# EasyEDA Pro project ProDoc_XIAOntegratedV2_2025-09-06.epro

# Schematic XIAOntegrated_1
Board Name: XIAOntegratedV2; Create Date: 2025-07-04; Page Name: MCU; Project Name: XIAOntegrated; Schematic Name: XIAOntegrated_1; Update Date: 2025-07-05; Company: EasyEDA.com; Page Size: A4; Version: V1.0
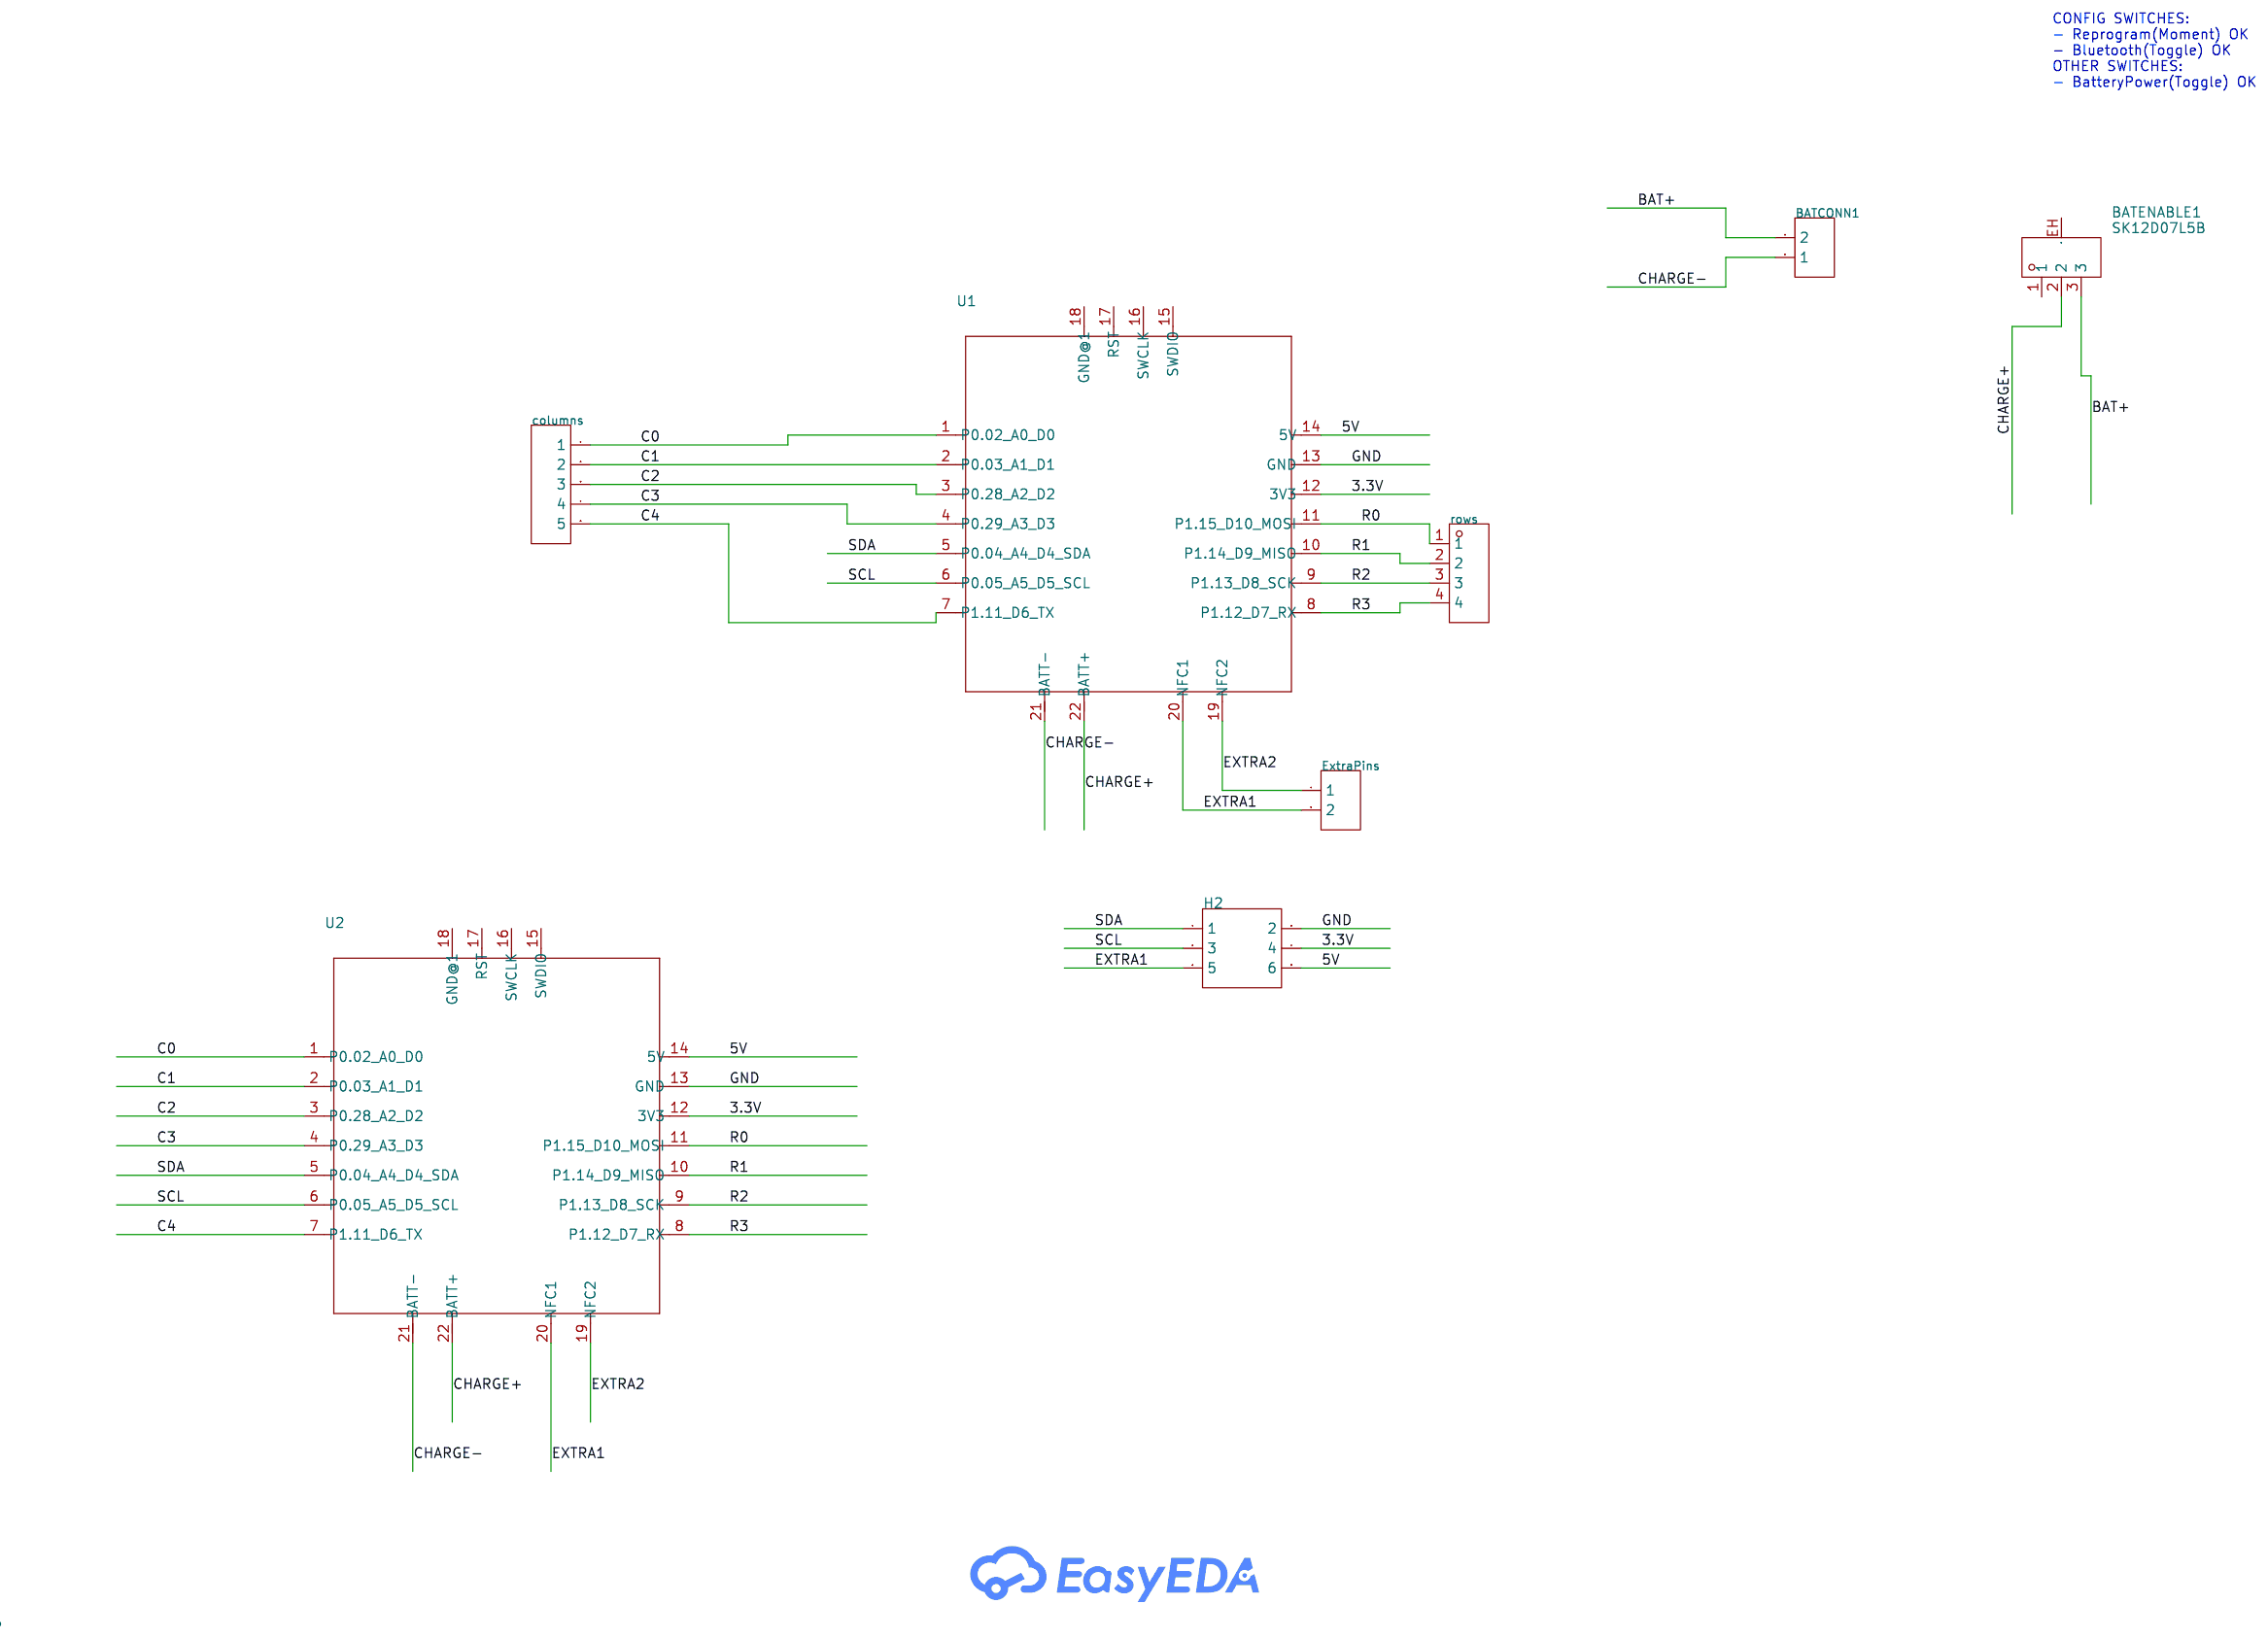
[diagram p0: schematic sheet]

## Parts
BATCONN1  -  [HDR-TH_2P-P2.54-V-F]
BATENABLE1  SK12D07L5B  [SW-TH_SK-12D07-X-X]
columns  -  [HDR-TH_5P-P2.54-V-F]
ExtraPins  -  [HDR-TH_2P-P2.54-V-F]
H2  -  [HDR-TH_6P-P2.54-V-F-R2-C3-S2.54]
rows  -  [HDR-TH_4P-P2.54-V-F]
U1  -  [XIAO-NRF52840/SENSE-MODULE14P-2.54-21X17.8MM]
U2  -  [XIAO-NRF52840/SENSE-MODULE14P-2.54-21X17.8MM]

## Library data of the parts
BATCONN1 ExtraPins = HDR-F_2.54_1x2P: Supplier Footprint: Through
BATENABLE1 = SK12D07L5B: Circuit:Single Pole Double Throw (SPDT) Actuator Style:Rectangular column Pin Style:PCPin Switch Length:8.6mm Switch Width:4.5mm Switch Height:4.7mm Mounting Style:- Actuator Color:Black Current Rating (DC):300mA Voltage Rating (DC):50V Current Rating (AC; LCSC Part Name: 2档侧拨手感极佳抗腐蚀24小时柄高5MM拨动开关SK-12D07-L5-B; Supplier Part: C480341; Manufacturer: XKB Connection(中国星坤); Supplier Footprint: 插件; JLCPCB Part Class: Extended Part; Datasheet: https://atta.szlcsc.com/upload/public/pdf/source/20211011/D45CBC84858A875519D538ABAE79099F.pdf; Supplier: LCSC; Circuit: Single Pole Double Throw (SPDT); Actuator Style: Rectangular column; Pin Style: PCPin; Switch Length: 8.6mm; Switch Width: 4.5mm; Switch Height: 4.7mm; Actuator Color: Black; Current Rating (DC): 300mA; Voltage Rating (DC): 50V; Current Rating (AC): 300mA; Voltage Rating (AC): 50V; Mechanical Life: 10000 times; Operating Temperature: -40℃~+85℃
columns = HDR-F_2.54_1x5P: Supplier Footprint: Through
H2 = HDR-F-2.54_2x3: Supplier Footprint: Through
rows = HDR-F_2.54_1x4P: Supplier Footprint: Through
U1 U2 = XIAO-NRF52840/SENSE_

## Nets
3.3V: H2.4 U1.12(3V3) U2.12(3V3)
5V: H2.6 U1.14(5V) U2.14(5V)
GND: H2.2 U1.13(GND) U2.13(GND)
BAT+: BATCONN1.2 BATENABLE1.3
C0: columns.1 U1.1(P0.02_A0_D0) U2.1(P0.02_A0_D0)
C1: columns.2 U1.2(P0.03_A1_D1) U2.2(P0.03_A1_D1)
C2: columns.3 U1.3(P0.28_A2_D2) U2.3(P0.28_A2_D2)
C3: columns.4 U1.4(P0.29_A3_D3) U2.4(P0.29_A3_D3)
C4: columns.5 U1.7(P1.11_D6_TX) U2.7(P1.11_D6_TX)
CHARGE+: BATENABLE1.2 U1.22(BATT+) U2.22(BATT+)
CHARGE-: BATCONN1.1 U1.21(BATT-) U2.21(BATT-)
EXTRA1: ExtraPins.2 H2.5 U1.20(NFC1) U2.20(NFC1)
EXTRA2: ExtraPins.1 U1.19(NFC2) U2.19(NFC2)
R0: rows.1 U1.11(P1.15_D10_MOSI) U2.11(P1.15_D10_MOSI)
R1: rows.2 U1.10(P1.14_D9_MISO) U2.10(P1.14_D9_MISO)
R2: rows.3 U1.9(P1.13_D8_SCK) U2.9(P1.13_D8_SCK)
R3: rows.4 U1.8(P1.12_D7_RX) U2.8(P1.12_D7_RX)
SCL: H2.3 U1.6(P0.05_A5_D5_SCL) U2.6(P0.05_A5_D5_SCL)
SDA: H2.1 U1.5(P0.04_A4_D4_SDA) U2.5(P0.04_A4_D4_SDA)

Not connected (* = marked no-connect by the designer): BATENABLE1 1 EH; U1 15(SWDIO) 16(SWCLK) 17(RST) 18(GND@1); U2 15(SWDIO) 16(SWCLK) 17(RST) 18(GND@1)

## Notes on the sheet
- CONFIG SWITCHES:
  - Reprogram(Moment) OK
  - Bluetooth(Toggle) OK
  OTHER SWITCHES:
  - BatteryPower(Toggle) OK

# Board PCB1_1
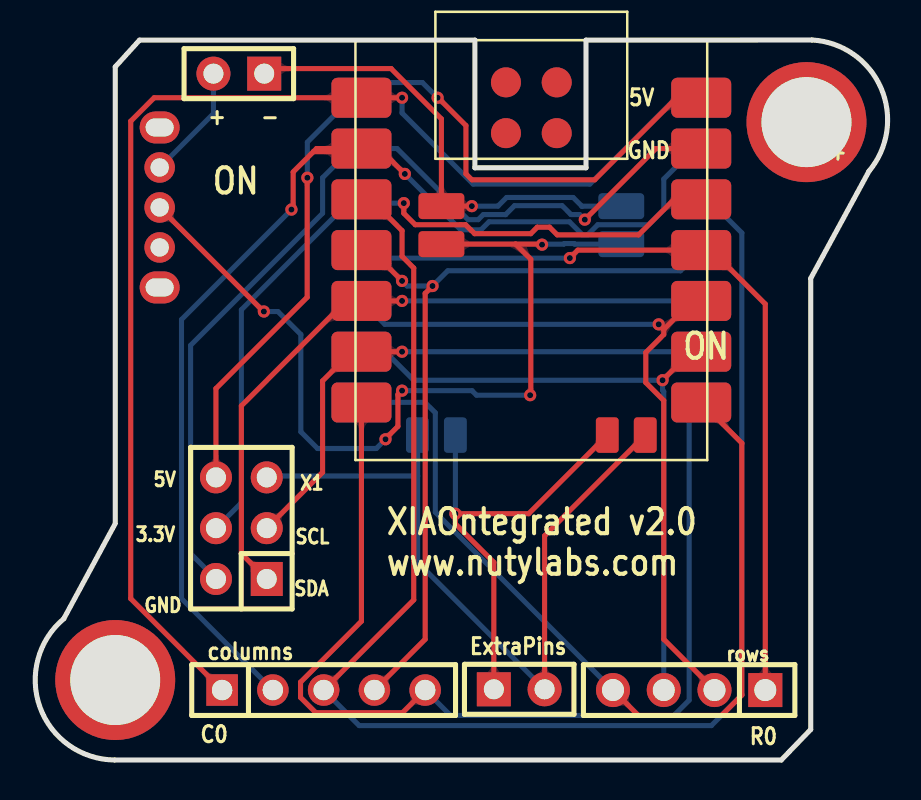
[diagram p1: board, top side]
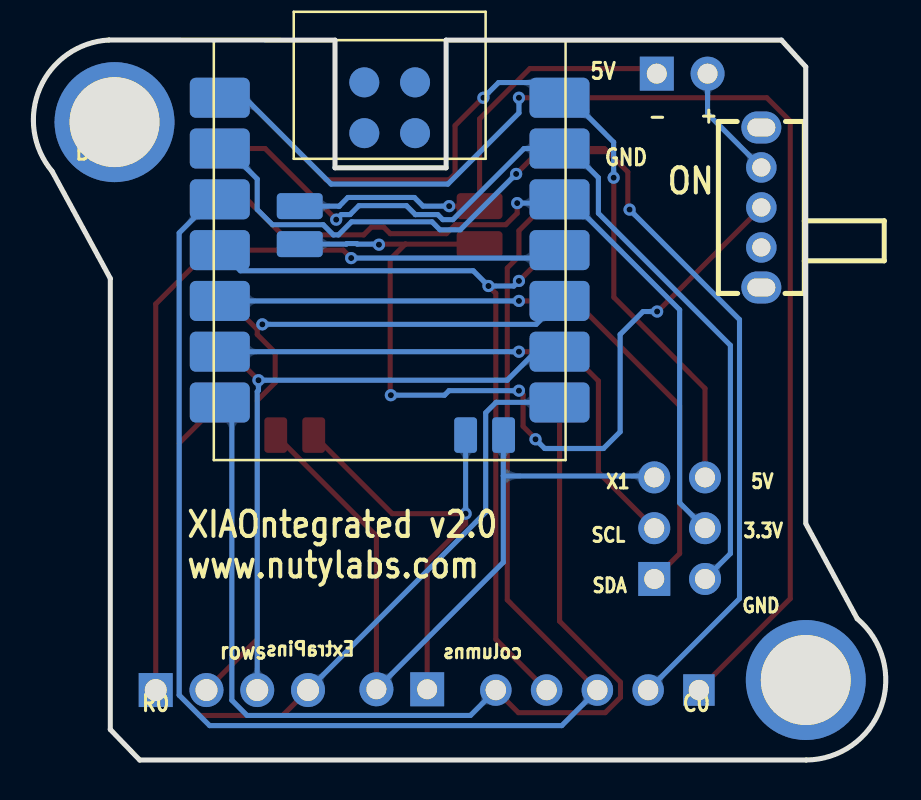
[diagram p2: board, bottom side, seen from below]

Outline 42.65 x 36.01 mm; copper layers: Top Layer, Bottom Layer. Coordinates in mm from the lower left corner of the outline.
Outline path: 4,11.82 1.43,7.06 arc(0.24,2.64) 3.98,0 37.33,0 38.8,1.53 38.8,24.08 41.71,29.44 arc(42.32,33.61) 38.86,36.01 27.56,36 27.56,29.62 22,29.62 22,36 5.22,36 4.01,34.66 4.01,11.86
Stack: Top Layer 0.035mm / Dielectric1 1.51mm FR4 er 4.5 / Bottom Layer 0.035mm

## Design rules (mm)
template: JLCPCB Capability(Two Layers Board)
spacing copperThickness1oz (default): track to track 0.102, other pairs 0.152 to 0.3
spacing copperThickness2oz: track to track 0.203, other pairs 0.152 to 0.3
track width copperThickness1oz (default): min 0.127, default 0.254, max 2.54
track width copperThickness2oz: min 0.203, default 0.254, max 2.54
differential pair differentialPair (default): width min 0.127, default 0.254, max 2.54; gap min 0.152, default 0.152
via viaSize (default): diameter min 0.5, default 0.61, max 10; hole min 0.3, default 0.305, max 6.3

## Placement (name value [footprint] x y rotation side)
BATCONN1  -  [HDR-TH_2P-P2.54-V-F]  10.19 34.32 180 top
BATENABLE1  SK12D07L5B  [SW-TH_SK-12D07-X-X]  6.23 27.63 90 bottom
columns  -  [HDR-TH_5P-P2.54-V-F]  14.43 3.5 0 top
ExtraPins  -  [HDR-TH_2P-P2.54-V-F]  24.22 3.54 0 top
H2  -  [HDR-TH_6P-P2.54-V-F-R2-C3-S2.54]  10.31 11.59 90 top
NOREF  -  [Pad_e0]  4 4 0 top
NOREF#2  -  [Pad_e1]  38.59 31.9 0 top
rows  -  [HDR-TH_4P-P2.54-V-F]  32.72 3.5 180 top
U1  -  [XIAO-NRF52840/SENSE-MODULE14P-2.54-21X17.8MM]  24.82 25.5 0 top
U2  -  [XIAO-NRF52840/SENSE-MODULE14P-2.54-21X17.8MM]  24.82 25.5 180 bottom

## Footprints (pads in the part's own frame, mm; a bottom-side part is the same pattern mirrored in y, then rotated)
HDR-TH_2P-P2.54-V-F
  rect 1.7x1.7 hole 1: 1(-1.27,0)
  round 1.7 hole 1: 2(1.27,0)
HDR-TH_4P-P2.54-V-F
  rect 1.7x1.7 hole 1.1: 1(-3.81,0)
  round 1.7 hole 1.1: 2(-1.27,0) 3(1.27,0) 4(3.81,0)
HDR-TH_5P-P2.54-V-F
  rect 1.575x1.575 hole 1.02: 1(-5.08,0)
  round 1.575 hole 1.02: 2(-2.54,0) 3(0,0) 4(2.54,0) 5(5.08,0)
HDR-TH_6P-P2.54-V-F-R2-C3-S2.54
  rect 1.7x1.6 hole 1: 1(-2.54,-1.27)
  round 1.6 hole 1: 2(-2.54,1.27) 3(0,-1.27) 4(0,1.27) 5(2.54,-1.27) 6(2.54,1.27)
Pad_e0
  round 6 hole 4.5: 1(0,0)
Pad_e1
  round 6 hole 4.5: 2(0,0)
SW-TH_SK-12D07-X-X
  round 1.524 hole 0.914: 1(-2,0) 2(0,0) 3(2,0)
  oval 1.6x2 hole 0.9x1.4: EH(-4,0) EH(4,0)
XIAO-NRF52840/SENSE-MODULE14P-2.54-21X17.8MM
  rrect 3x2 smd: 1(-8.5,7.62) 2(-8.5,5.08) 3(-8.5,2.54) 4(-8.5,0) 5(-8.5,-2.54) 6(-8.5,-5.08) 7(-8.5,-7.62) 8(8.5,-7.62) 9(8.5,-5.08) 10(8.5,-2.54) 11(8.5,0) 12(8.5,2.54) 13(8.5,5.08) 14(8.5,7.62)
  round 1.5 smd: 15(-1.27,8.39) 16(1.27,8.39) 17(-1.27,5.85) 18(1.27,5.85)
  rrect 1.143x1.778 smd: 19(3.8,-9.25) 20(5.7,-9.25)
  rrect 2.3x1.3 smd: 21(-4.5,2.2) 22(-4.5,0.3)

## Nets
As in the schematic.

Pads without a net: BATENABLE1 1 EH; NOREF 1; NOREF#2 2; U1 15 16 17 18; U2 15 16 17 18

## Via types
v1: diameter 0.61, hole 0.305, Top Layer to Bottom Layer, 21 vias

## Routing (per net, layer and track width the routed paths; a pad name or vN(x,y) marks a point on that pad's centre or on a via; arc(x,y) is an arc through that point)
3.3V: length 39.4
  Top Layer w0.254: 21.28,26.77 19.02,26.77 18.44,27.34 v1(18.44,27.85) ; 21.81,26.49 21.53,26.77 21.28,26.77 ; U1.12 31.97,28.04 30.19,26.26 26.12,26.26 25.74,26.64 25.12,26.64 24.8,26.32 21.99,26.32 21.81,26.49
  Bottom Layer w0.254: U2.12 15.84,28.04 15.65,27.85 ; H2.4 10.31,12.86 10.31,22.52 15.65,27.85 ; 15.65,27.85 v1(18.44,27.85)
5V: length 44.7
  Top Layer w0.254: H2.6 9.05,18.58 13.61,23.14 13.61,29.11 v1(13.62,29.12) ; v1(20.14,33.12) 20.16,33.12 21.55,31.73 21.55,29.31 21.85,29.02 28,29.02 32.1,33.12 U1.14
  Bottom Layer w0.254: v1(13.62,29.12) 13.62,30.9 15.84,33.12 U2.14 17.08,33.88 19.37,33.88 v1(20.13,33.12)
GND: length 46.4
  Top Layer w0.254: U1.13 31.05,30.58 v1(27.5,27.02)
  Bottom Layer w0.254: 26.8,27.28 26.36,27.72 23.98,27.72 23.54,27.28 ; 23.54,27.28 22.42,27.28 22.17,27.02 21.66,27.02 18.1,30.58 U2.13 15.84,30.58 14.38,29.12 14.38,27.34 7.78,20.74 7.78,10.32 H2.2 ; 23.54,27.28 23.53,27.27 ; v1(27.5,27.02) 27.25,27.28 26.8,27.28
BAT+: length 5.8
  Bottom Layer w0.254: BATENABLE1.3 8.92,32.32 BATCONN1.2
C0: length 63.4
  Top Layer w0.254: columns.1 4.78,8.07 4.78,31.95 5.95,33.12 U1.1 v1(18.36,33.12)
  Bottom Layer w0.254: U2.1 32.07,33.12 27.76,28.8 21.91,28.8 18.36,32.36 v1(18.36,33.12)
C1: length 58.2
  Top Layer w0.254: 13.93,30.42 14.08,30.58 U1.2 ; 13.93,30.42 17.38,30.42 v1(18.5,29.31) ; 13.93,30.42 12.91,29.41 12.91,27.61 v1(12.82,27.53)
  Bottom Layer w0.254: columns.2 7.32,8.07 7.32,22.03 v1(12.82,27.53) ; v1(18.5,29.31) 21.29,26.52 22.31,26.52 22.71,26.91 26.73,26.91 27.39,26.26 27.64,26.26 28.15,26.77 30.69,26.77 31.45,27.53 31.45,29.06 32.98,30.58 U2.2
C2: length 75.9
  Top Layer w0.254: U1.3 16.79,28.04 18.35,26.47 18.35,25.19 18.94,24.6 18.94,8.01 columns.3
  Bottom Layer w0.254: U2.3 33.67,28.04 35.35,26.36 35.35,3.24 33.83,1.72 16.21,1.72 columns.3
C3: length 39.9
  Top Layer w0.254: columns.4 19.51,6.04 19.51,23.34 v1(19.88,23.7) ; v1(18.36,23.96) 16.82,25.5 U1.4
  Bottom Layer w0.254: v1(18.35,23.96) 18.61,23.7 v1(19.88,23.7) 20.64,24.47 32.29,24.47 U2.4
C4: length 52.2
  Top Layer w0.254: columns.5 18.38,2.37 14.04,2.37 13.27,3.13 13.27,3.89 16.32,6.94 16.32,17.88
  Bottom Layer w0.254: 33.33,17.88 32.72,17.28 32.72,2.99 31.96,2.23 20.78,2.23 columns.5
CHARGE+: length 45.4
  Top Layer w0.254: 24.8,18.22 24.8,25.04 24.04,25.8 ; 20.33,25.8 24.04,25.8 ; 24.04,25.8 25.33,25.8 v1(25.36,25.77) ; 24.04,25.8 24.04,25.8 ; 6.33,27.52 11.42,22.43 v1(11.44,22.43) ; v1(18.36,18.47) 18.35,18.47 18.15,18.27 18.15,16.69 17.53,16.06 v1(17.53,16.04)
  Bottom Layer w0.254: v1(25.36,25.77) 25.39,25.8 26.45,25.8 26.48,25.83 26.96,25.83 26.99,25.8 29.33,25.8 ; v1(24.77,18.24) 22.08,18.24 21.86,18.47 v1(18.36,18.47) ; v1(17.53,16.04) 17.07,15.58 14.13,15.58 13.29,16.41 13.29,21.28 12.15,22.43 v1(11.44,22.43)
CHARGE-: length 23.8
  Top Layer w0.254: BATCONN1.1 11.71,34.58 17.81,34.58 20.33,32.06 U1.21 v1(21.85,27.7)
  Bottom Layer w0.254: 27.35,27.7 26.92,28.13 23.59,28.13 23.16,27.7 v1(21.85,27.7) ; 27.35,27.7 U2.21 ; 27.35,27.7 27.37,27.68
EXTRA1: length 37.7
  Top Layer w0.254: ExtraPins.2 25.49,11.21 U1.20
  Bottom Layer w0.254: H2.5 11.66,14.2 19.14,14.2 ; U2.20 19.14,16.23 19.14,14.2 ; ExtraPins.2 19.14,9.89 19.14,14.2
EXTRA2: length 22.7
  Top Layer w0.254: U1.19 24.69,12.32 v1(21.02,12.32) 21.02,11.81 22.95,9.89 ExtraPins.1
  Bottom Layer w0.254: v1(21.02,12.32) U2.19
R0: length 41
  Top Layer w0.254: v1(26.75,25.1) 27.15,25.5 U1.11 33.83,25.5 36.53,22.8 rows.1
  Bottom Layer w0.254: v1(26.75,25.1) 16.72,25.1 U2.11
R1: length 38
  Top Layer w0.254: 31.45,21.53 31.45,21.28 30.55,20.38 30.55,18.87 31.45,17.98 31.45,6.04 rows.2 ; 31.45,21.53 v1(31.2,21.79) ; 31.45,21.53 32.88,22.96 33.33,22.96
  Bottom Layer w0.254: 16.33,22.96 17.5,21.79 v1(31.2,21.79)
R2: length 33.7
  Top Layer w0.254: U1.9 32.81,20.42 v1(31.39,18.99)
  Bottom Layer w0.254: U2.9 17.52,20.42 18.94,18.99 v1(31.39,18.99) 31.39,18.48 31.45,18.42 rows.3
R3: length 44.3
  Top Layer w0.254: 33.32,17.88 35.35,15.85 35.35,3.24 34.34,2.23 30.18,2.23 rows.4
  Bottom Layer w0.254: rows.4 20.02,12.39 20.02,17.37 19.5,17.89 16.33,17.89 16.33,17.88
SCL: length 28.1
  Top Layer w0.254: v1(18.35,20.42) U1.6 15.84,20.42 14.38,18.96 14.38,14.39 H2.3
  Bottom Layer w0.254: v1(18.35,20.42) U2.6
SDA: length 34.4
  Top Layer w0.254: H2.1 10.31,10.32 10.31,17.71 15.56,22.96 v1(18.35,22.96)
  Bottom Layer w0.254: v1(18.35,22.96) 33.32,22.96

Small or netless copper shapes (teardrops, artwork), in the pictures only: 63 on Top Layer, 55 on Bottom Layer

## Text on the board
Bottom Silkscreen Layer: 5V | 3.3V | GND | X1 | SDA | SCL | rows | R0 | + | C0 | - | BAT+ | ON | XIAOntegrated v2.0 / www.nutylabs.com
Top Silkscreen Layer: 3.3V | GND | 5V | SDA | SCL | X1 | ExtraPins | C0 | columns | + | - | BAT+ | R0 | ON | XIAOntegrated v2.0 / www.nutylabs.com
